# Altium schematic sheet RELEASE.SchDoc
size A3; Revision: 1.0; SheetNumber: 1; SheetTotal: 7
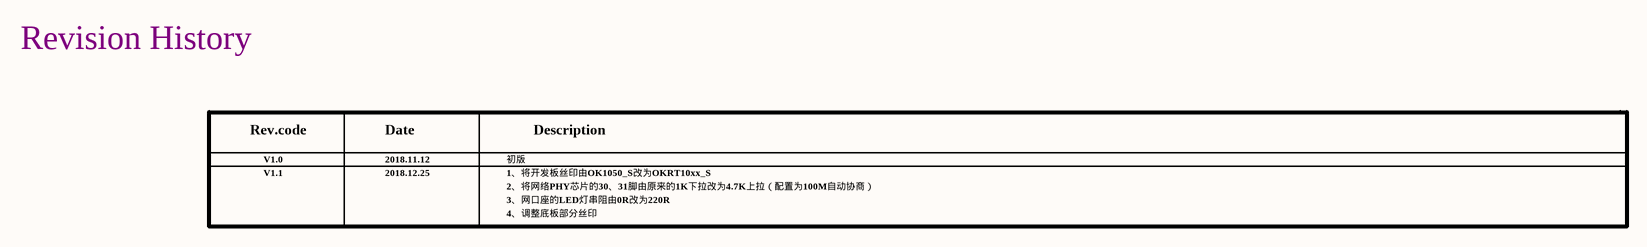
[diagram p0: RELEASE.SchDoc]

## Notes on the sheet
- Revision History
- Rev.code
- Date
- Description
- V1.0
- V1.1
- 2018.11.12
- 2018.12.25
- 初版
- 1、将开发板丝印由OK1050_S改为OKRT10xx_S
- 2、将网络PHY芯片的30、31脚由原来的1K下拉改为4.7K上拉（配置为100M自动协商）
- 3、网口座的LED灯串阻由0R改为220R
- 4、调整底板部分丝印
- 设计
- 审核
- 工艺
- 图纸名称
- 郝成东
- 批准
- 标准化
- 日期
- 版本
- 页码
- 第
- 页
- 共